# Altium schematic sheet MAZ000166 - Diagrama eléctrico.SchDoc: MAZ000166 - Diagrama eléctrico
size A; ApprovedBy: Christian Ledwidth; CheckedBy: Nahuel Martinez; Author: Santiago Marti; CompanyName: Body Health; DrawnBy: Santiago Marti; Revision: A; SheetNumber: 1; SheetTotal: 2
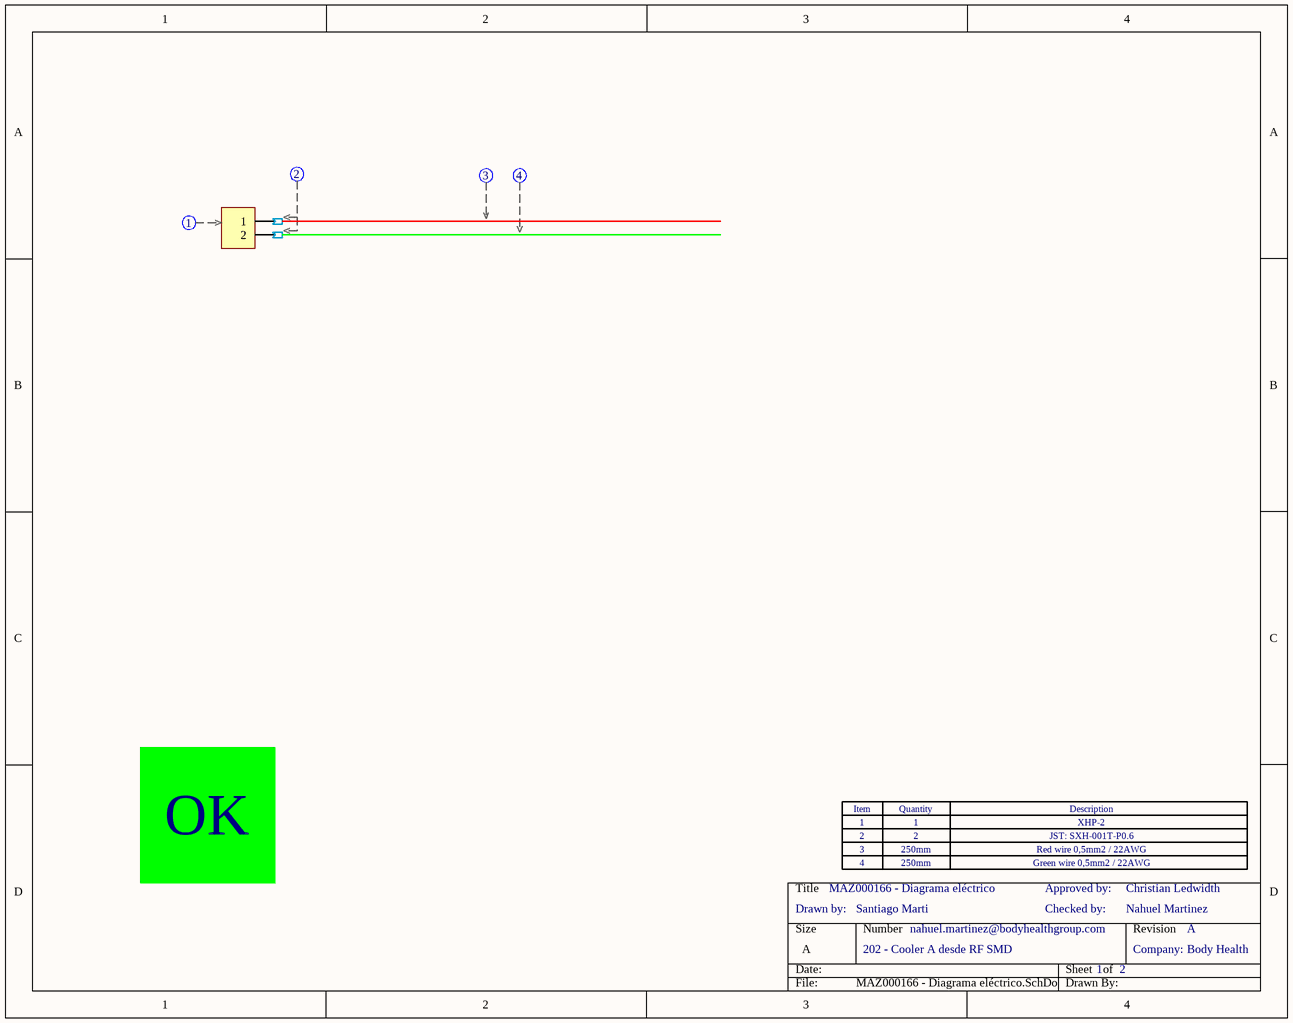
[diagram p0: MAZ000166 - Diagrama eléctrico.SchDoc]

## Parts
Con1  XHP-2  (value not drawn)  (parts C,D of 4)
Soc1  sock_XHP_SXH-002T-P0.6  (value not drawn)  (parts A,B of 2)
Soc2  sock_XHP_SXH-002T-P0.6  (value not drawn)  (parts A,B of 2)
Soc4  sock_XHP_SXH-002T-P0.6  (value not drawn)  (part A of 2)
Zoc1  Zócalo_Header  (value not drawn)
Zoc2  Zócalo_Item  (value not drawn)
Zoc3  Zócalo_Item  (value not drawn)
Zoc4  Zócalo_Item  (value not drawn)
Zoc5  Zócalo_Item  (value not drawn)

## Nets
NetCon1_1: Con1.1 Soc1.0
NetCon1_2: Con1.2 Soc2.0

Not connected (* = marked no-connect by the designer): Soc1 1; Soc2 1

## Notes on the sheet
- OK
- 1
- 2
- XHP-2
- JST: SXH-001T-P0.6
- Drawn by:
- 3
- 4
- 250mm
- Checked by:
- Approved by:
- Red wire 0,5mm2 / 22AWG
- Green wire 0,5mm2 / 22AWG
- 202 - Cooler A desde RF SMD
- nahuel.martinez@bodyhealthgroup.com
- Company:
- (in symbol Zócalo_Header) Item; Quantity; Description

## Library data of the parts
Con1 = XHP-2: CONN HOUSING 2.5MM 2POS; Fabricante: JST Sales America Inc.; CallOut: 1; Cod.DigiKey: 455-2266-ND; Cod.Fabricante: XHP-2; ComponentLink1Description: Manufacturer Link; ComponentLink1URL: http://www.jst-mfg.com/product/pdf/eng/eXH.pdf; DIGIKEYx50: 0.05620; DIGIKEYx100: NO
Soc1 = sock_XHP_SXH-002T-P0.6: CONN SOCKET 26-30AWG CRIMP TIN; Fabricante: JST Sales America Inc.; CallOut: 3; Cod.DigiKey: 455-2261-1-ND; Cod.Fabricante: SXH-002T-P0.6; ComponentLink1Description: Manufacturer Link; ComponentLink1URL: http://www.jst-mfg.com/product/pdf/eng/eXH.pdf; DIGIKEYx100: 0.03300; DIGIKEYx50: 0.03420
Soc2 = sock_XHP_SXH-002T-P0.6: CONN SOCKET 26-30AWG CRIMP TIN; Fabricante: JST Sales America Inc.; CallOut: 4; Cod.DigiKey: 455-2261-1-ND; Cod.Fabricante: SXH-002T-P0.6; ComponentLink1Description: Manufacturer Link; ComponentLink1URL: http://www.jst-mfg.com/product/pdf/eng/eXH.pdf; DIGIKEYx100: 0.03300; DIGIKEYx50: 0.03420
Soc4 = sock_XHP_SXH-002T-P0.6: CONN SOCKET 26-30AWG CRIMP TIN; Fabricante: JST Sales America Inc.; CallOut: 2; Cod.DigiKey: 455-2261-1-ND; Cod.Fabricante: SXH-002T-P0.6; ComponentLink1Description: Manufacturer Link; ComponentLink1URL: http://www.jst-mfg.com/product/pdf/eng/eXH.pdf; DIGIKEYx100: 0.03300; DIGIKEYx50: 0.03420
Zoc1 = Zócalo_Header: Header para el zócalo de referencias
Zoc2-Zoc5 = Zócalo_Item: Ítem para el zócalo de referencias; Desginator: *; Quantity: *; ItemDescription: *